# EAGLE design Rocket-Control4 (EAGLE 7.6.0)
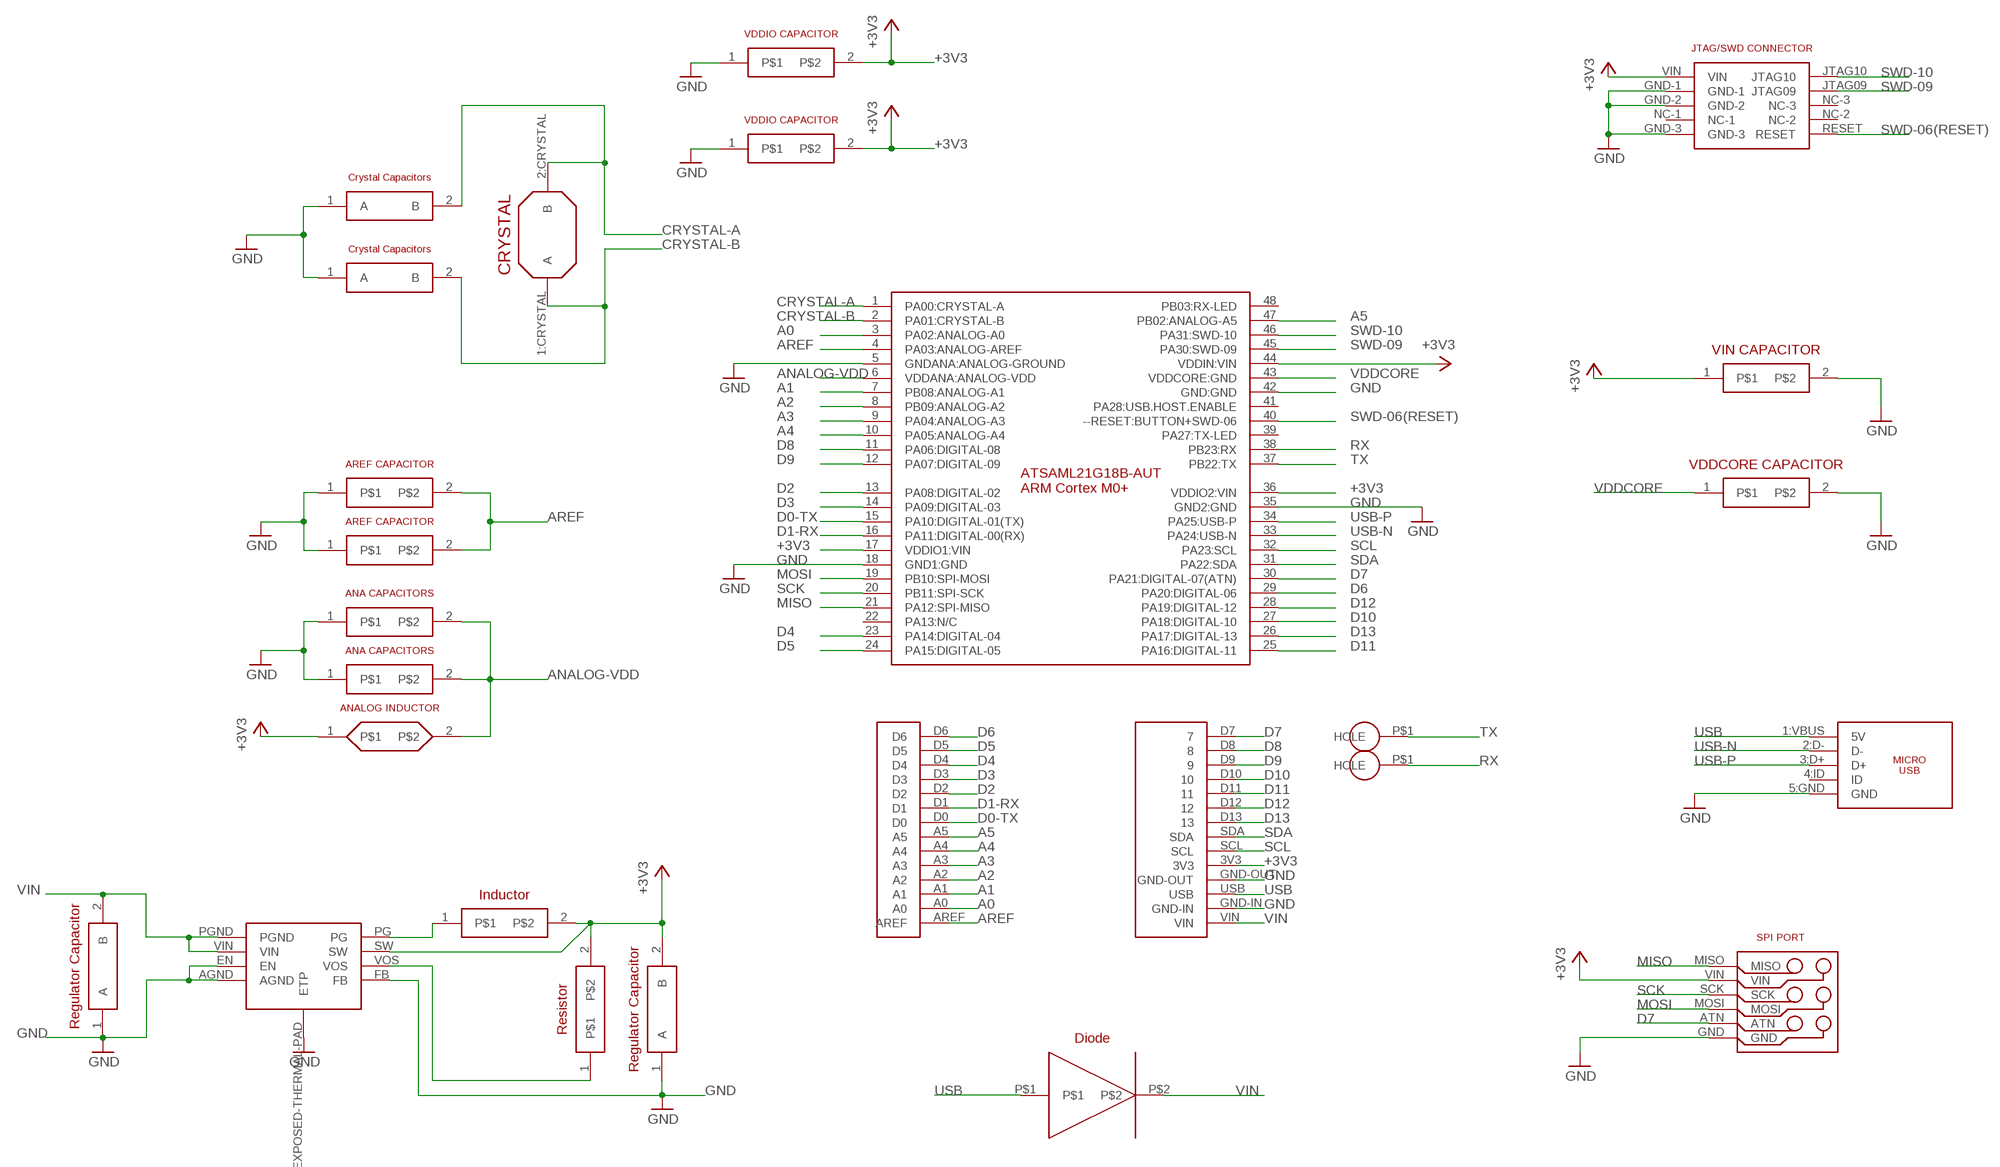
[diagram p0: schematic, sheet 1]

## Parts
U$1  ATSAML21G18B-AUT  [TQFP48]
U$2  CRYSTAL-CAPACITORS  [C0603]
U$3  CRYSTAL-CAPACITORS  [C0603]
U$4  CRYSTAL  [4-SOJ:CRYSTAL]
U$5  REGULATOR  [8-WFDFN-EXPOSED-PAD]
U$6  AREF-CAPACITORS  [C0402]
U$7  AREF-CAPACITORS  [C0402]
U$8  ANALOG-CAPACITORS  [C0402]
U$9  ANALOG-CAPACITORS  [C0402]
U$10  ANALOG-INDUCTOR  [C0603]
U$11  REGULATOR-CAPACITORS  [C0402]
U$12  REGULATOR-CAPACITORS  [C0402]
U$13  REGULATOR-INDUCTOR  [C0603]
U$14  REGULATOR-RESISTOR  [C0603]
U$15  REGULATION-DIODE  [SOD-882]
U$16  HEADER-HOLE  [HEADER-HOLE]
U$17  HEADER-HOLE  [HEADER-HOLE]
U$21  HEADER-SIDE-A  [HEADER-SIDE-A]
U$22  HEADER-SIDE-B  [HEADER-SIDE-B]
U$26  VDDIO-CAPACITOR  [C0402]
U$35  VDDIO-CAPACITOR  [C0402]
U$38  10118194-0001LF:MICRO-USB  [10118194-0001LF:MICRO-USB-B]
U$41  SPI-PORT  [SPI-PORT]
U$56  VDDCORE-CAPACITOR  [C0402]
U$57  VIN-CAPACITOR  [C0402]
U$61  JTAG-MINI  [JTAG-MINI]

## Nets
+3V3: U$1.17(VDDIO1:VIN) U$1.36(VDDIO2:VIN) U$1.44(VDDIN:VIN) U$5.SW U$10.1 U$12.2(B) U$13.2 U$14.2 U$22.3V3 U$26.2 U$35.2 U$41.VIN U$57.1 U$61.VIN
A0: U$1.3(PA02:ANALOG-A0) U$21.A0
A1: U$1.7(PB08:ANALOG-A1) U$21.A1
A2: U$1.8(PB09:ANALOG-A2) U$21.A2
A3: U$1.9(PA04:ANALOG-A3) U$21.A3
A4: U$1.10(PA05:ANALOG-A4) U$21.A4
A5: U$1.47(PB02:ANALOG-A5) U$21.A5
ANALOG-VDD: U$1.6(VDDANA:ANALOG-VDD) U$8.2 U$9.2 U$10.2
AREF: U$1.4(PA03:ANALOG-AREF) U$6.2 U$7.2 U$21.AREF
CRYSTAL-A: U$1.1(PA00:CRYSTAL-A) U$2.2(B) U$4.2:CRYSTAL(B)
CRYSTAL-B: U$1.2(PA01:CRYSTAL-B) U$3.2(B) U$4.1:CRYSTAL(A)
D0-TX: U$1.15(PA10:DIGITAL-01(TX)) U$21.D0
D1-RX: U$1.16(PA11:DIGITAL-00(RX)) U$21.D1
D2: U$1.13(PA08:DIGITAL-02) U$21.D2
D3: U$1.14(PA09:DIGITAL-03) U$21.D3
D4: U$1.23(PA14:DIGITAL-04) U$21.D4
D5: U$1.24(PA15:DIGITAL-05) U$21.D5
D6: U$1.29(PA20:DIGITAL-06) U$21.D6
D7: U$1.30(PA21:DIGITAL-07(ATN)) U$22.D7 U$41.ATN
D8: U$1.11(PA06:DIGITAL-08) U$22.D8
D9: U$1.12(PA07:DIGITAL-09) U$22.D9
D10: U$1.27(PA18:DIGITAL-10) U$22.D10
D11: U$1.25(PA16:DIGITAL-11) U$22.D11
D12: U$1.28(PA19:DIGITAL-12) U$22.D12
D13: U$1.26(PA17:DIGITAL-13) U$22.D13
GND: U$1.5(GNDANA:ANALOG-GROUND) U$1.18(GND1:GND) U$1.35(GND2:GND) U$1.42(GND:GND) U$2.1(A) U$3.1(A) U$5.AGND U$5.EN U$5.EXPOSED-THERMAL-PAD(ETP) U$5.FB U$6.1 U$7.1 U$8.1 U$9.1 U$11.1(A) U$12.1(A) U$22.GND-IN U$22.GND-OUT U$26.1 U$35.1 U$38.5:GND(GND) U$41.GND U$56.2 U$57.2 U$61.GND-1 U$61.GND-2 U$61.GND-3
MISO: U$1.21(PA12:SPI-MISO) U$41.MISO
MOSI: U$1.19(PB10:SPI-MOSI) U$41.MOSI
N$1: U$5.PG U$13.1
N$3: U$5.VOS U$14.1
RX: U$1.38(PB23:RX) U$17.P$1(HOLE)
SCK: U$1.20(PB11:SPI-SCK) U$41.SCK
SCL: U$1.32(PA23:SCL) U$22.SCL
SDA: U$1.31(PA22:SDA) U$22.SDA
SWD-06(RESET): U$1.40(--RESET:BUTTON+SWD-06) U$61.RESET
SWD-09: U$1.45(PA30:SWD-09) U$61.JTAG09
SWD-10: U$1.46(PA31:SWD-10) U$61.JTAG10
TX: U$1.37(PB22:TX) U$16.P$1(HOLE)
USB: U$15.P$1 U$22.USB U$38.1:VBUS(5V)
USB-N: U$1.33(PA24:USB-N) U$38.2:D-(D-)
USB-P: U$1.34(PA25:USB-P) U$38.3:D+(D+)
VDDCORE: U$1.43(VDDCORE:GND) U$56.1
VIN: U$5.PGND U$5.VIN U$11.2(B) U$15.P$2 U$22.VIN
Unconnected: U$1.22(PA13:N/C) U$1.39(PA27:TX-LED) U$1.41(PA28:USB.HOST.ENABLE) U$1.48(PB03:RX-LED) U$38.4:ID(ID) U$61.NC-1 U$61.NC-2 U$61.NC-3

## Library data of the parts
U$1 = RocketControlBoard:ATSAML21G18B-AUT
U$2 U$3 = RocketControlBoard:CRYSTAL-CAPACITORS
U$4 = RocketControlBoard:CRYSTAL
U$5 = RocketControlBoard:REGULATOR
U$6 U$7 = RocketControlBoard:AREF-CAPACITORS
U$8 U$9 = RocketControlBoard:ANALOG-CAPACITORS
U$10 = RocketControlBoard:ANALOG-INDUCTOR
U$11 U$12 = RocketControlBoard:REGULATOR-CAPACITORS
U$13 = RocketControlBoard:REGULATOR-INDUCTOR
U$14 = RocketControlBoard:REGULATOR-RESISTOR
U$15 = RocketControlBoard:REGULATION-DIODE
U$16 U$17 = RocketControlBoard:HEADER-HOLE
U$21 = RocketControlBoard:HEADER-SIDE-A
U$22 = RocketControlBoard:HEADER-SIDE-B
U$26 U$35 = RocketControlBoard:VDDIO-CAPACITOR
U$38 = RocketControlBoard:10118194-0001LF:MICRO-USB
U$41 = RocketControlBoard:SPI-PORT
U$56 = RocketControlBoard:VDDCORE-CAPACITOR
U$57 = RocketControlBoard:VIN-CAPACITOR
U$61 = RocketControlBoard:JTAG-MINI

## Board
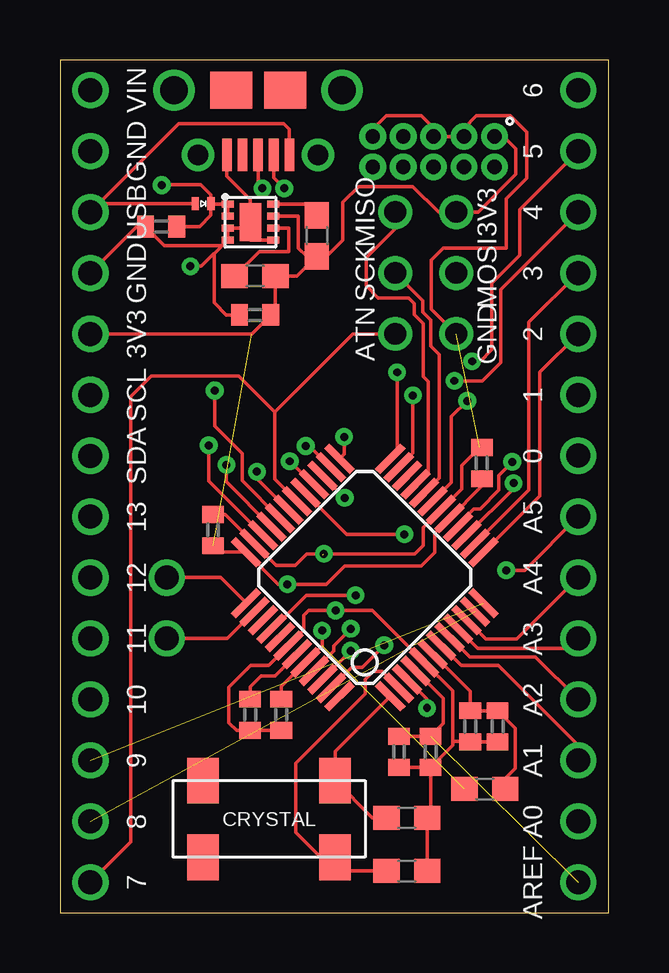
[diagram p1: board, top side]
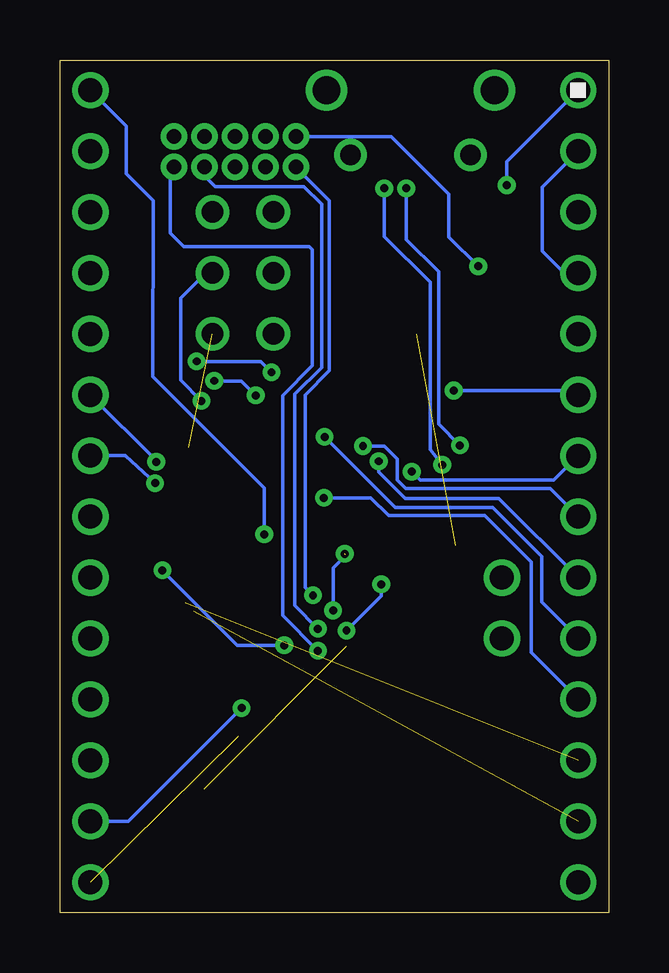
[diagram p2: board, bottom side, seen from below]

Size 22.86 x 35.55 mm. Coordinates in mm from the lower left corner, seen from the top.
Outline: 0,0 22.86,0 22.86,35.55 0,35.55 0,0
Copper layers (1*16): Top 0.035mm / dielectric 1.5mm / Bottom 0.035mm
Design rules "pcbway": minimum track width 6mil, minimum drill 12mil, track to track 6mil, track to pad 6mil, pad to pad 6mil, via to via 6mil, smd to smd 6mil, copper to edge 6mil, drill to drill 6mil, minimum pad ring 10mil, minimum via ring 8mil, stop-mask expansion 4mil, vias tented up to drill 0mil, thermal gap 10mil

### Footprints (pad centres in the part's own frame; a part is rotated, then mirrored left to right if it is on the bottom)
TQFP48 = smd 0.3 x 1.5: 1 -2.75,-4.25; 2 -2.25,-4.25; 3 -1.75,-4.25; 4 -1.25,-4.25; 5 -0.75,-4.25; 6 -0.25,-4.25; 7 0.25,-4.25; 8 0.75,-4.25; 9 1.25,-4.25; 10 1.75,-4.25; 11 2.25,-4.25; 12 2.75,-4.25; 25 2.75,4.25; 26 2.25,4.25; 27 1.75,4.25; 28 1.25,4.25; 29 0.75,4.25; 30 0.25,4.25; 31 -0.25,4.25; 32 -0.75,4.25; 33 -1.25,4.25; 34 -1.75,4.25; 35 -2.25,4.25; 36 -2.75,4.25 | smd 1.5 x 0.3: 13 4.25,-2.75; 14 4.25,-2.25; 15 4.25,-1.75; 16 4.25,-1.25; 17 4.25,-0.75; 18 4.25,-0.25; 19 4.25,0.25; 20 4.25,0.75; 21 4.25,1.25; 22 4.25,1.75; 23 4.25,2.25; 24 4.25,2.75; 37 -4.25,2.75; 38 -4.25,2.25; 39 -4.25,1.75; 40 -4.25,1.25; 41 -4.25,0.75; 42 -4.25,0.25; 43 -4.25,-0.25; 44 -4.25,-0.75; 45 -4.25,-1.25; 46 -4.25,-1.75; 47 -4.25,-2.25; 48 -4.25,-2.75
C0603 = smd 1.1 x 1: 1 -0.85,0; 2 0.85,0
4-SOJ:CRYSTAL = smd 1.3 x 1.9: 1:CRYSTAL -2.75,1.6; 2:CRYSTAL -2.75,-1.6; 3:N/C 2.75,1.6; 4:N/C 2.75,-1.6
8-WFDFN-EXPOSED-PAD = smd 0.28 x 0.5: AGND 1.5,0; EN 1,0; FB 1.5,1.9; PG 0,1.9; PGND 0,0; SW 0.5,1.9; VIN 0.5,0; VOS 1,1.9 | smd 1.6 x 0.9: EXPOSED-THERMAL-PAD 0.75,0.95
C0402 = smd 0.7 x 0.9: 1 -0.65,0; 2 0.65,0
SOD-882 = smd 0.3 x 0.55: P$1 0,0; P$2 0.65,0
HEADER-HOLE = drill 1: P$1 0,0
HEADER-SIDE-A = drill 1: A0 0,-12.7; A1 0,-10.16; A2 0,-7.62; A3 0,-5.08; A4 0,-2.54; A5 0,0; AREF 0,-15.24; D0 0,2.54; D1 0,5.08; D2 0,7.62; D3 0,10.16; D4 0,12.7; D5 0,15.24; D6 0,17.78
HEADER-SIDE-B = drill 1: 3V3 -12.7,0; D7 -35.56,0; D8 -33.02,0; D9 -30.48,0; D10 -27.94,0; D11 -25.4,0; D12 -22.86,0; D13 -20.32,0; GND-IN -5.08,0; GND-OUT -10.16,0; SCL -15.24,0; SDA -17.78,0; USB -7.62,0; VIN -2.54,0
10118194-0001LF:MICRO-USB-B = smd 1.35 x 0.4: 1:VBUS 2.7,1.3; 2:D- 2.7,0.65; 3:D+ 2.7,0; 4:ID 2.7,-0.65; 5:GND 2.7,-1.3 | drill 0.85: NC1 2.7,2.5; NC6 2.7,-2.5 | drill 1.15: NC2 0,3.5; NC5 0,-3.5 | smd 1.55 x 1.75: NC3 0,1.125; NC4 0,-1.125
SPI-PORT = drill 0.9: ATN 0,0; GND 2.54,0; MISO 0,5.08; MOSI 2.54,2.54; SCK 0,2.54; VIN 2.54,5.08
JTAG-MINI = drill 0.6: GND-1 0.635,4.445; GND-2 0.635,3.175; GND-3 0.635,0.635; JTAG09 1.905,4.445; JTAG10 1.905,5.715; NC-1 0.635,1.905; NC-2 1.905,1.905; NC-3 1.905,3.175; RESET 1.905,0.635; VIN 0.635,5.715

### Placement (x,y rotation side)
U$1  12.7,13.97 45 top
U$2  14.45,3.96 180 top
U$3  14.45,1.75 180 top
U$4  8.71,3.91 180 top
U$5  6.99,29.54 270 top
U$6  15.44,6.71 90 top
U$7  14.12,6.71 90 top
U$8  18.24,7.77 90 top
U$9  17.09,7.77 90 top
U$10  17.7,5.16 0 top
U$11  4.22,28.6 0 top
U$12  8.13,24.92 0 top
U$13  10.69,28.22 270 top
U$14  8.13,26.54 0 top
U$15  5.64,29.57 0 top
U$16  4.45,13.97 0 top
U$17  4.45,11.43 0 top
U$21  21.59,16.51 0 top
U$22  1.27,36.83 90 top
U$26  17.58,18.75 270 top
U$35  6.38,15.95 270 top
U$38  8.26,34.29 270 top
U$41  13.97,24.13 0 top
U$56  7.92,8.26 270 top
U$57  9.22,8.26 270 top
U$61  12.4,32.99 270 top

### Tracks (layer width: path | path; a pad name or v marks a point on that pad's centre or on a via)
+3V3  (via drill 0.33)  (2 unrouted)
  Top 0.152: U$1.44 9.77,9.98 | U$61.VIN 18.49,32.36 19,31.85 19,30.79 17.42,29.21 U$41.VIN 15.77,29.21 14.71,30.28 12.45,30.28 11.79,29.62 11.79,28.04 11.11,27.37 U$13.2 | U$26.2 17.58,17.79 U$1.17 15.62,15.83 15.62,15.01 15.06,14.45 11.86,14.45 11.1,13.69 v9.47,13.69 9.09,13.69 U$1.36 6.65,15.03 U$35.2 | U$1.44 9.22,9.43 U$57.1 | U$5.SW 9.93,29.04 9.93,27.71 10.27,27.37 U$13.2 | U$13.2 9.87,26.54 U$14.2 8.98,25.12 U$12.2 7.99,24.13 U$22.3V3 | U$1.44 10.92,11.13 v10.92,11.76
  Bottom 0.152: v10.92,11.76 9.47,13.21 v9.47,13.69
A0  (via drill 0.33)
  Top 0.152: U$1.3 15.29,8.9 v15.29,8.53
  Bottom 0.152: U$21.A0 20.02,3.81 v15.29,8.53
A1
  Top 0.152: U$1.7 16.71,10.31 18.26,10.31 21.59,6.99 U$21.A1
A2
  Top 0.152: U$1.8 17.06,10.67 19.81,10.67 U$21.A2
A3
  Top 0.152: U$1.9 17.41,11.02 21.18,11.02 U$21.A3
A4
  Top 0.152: U$1.10 17.74,11.4 19.02,11.4 U$21.A4
A5  (via drill 0.33)
  Top 0.152: U$21.A5 19.36,14.28 v18.59,14.28 | U$1.47 12.15,10.24 12.6,10.24 v13.51,11.15
  Bottom 0.152: v18.59,14.28 15.47,11.15 v13.51,11.15
ANALOG-VDD
  Top 0.152: U$1.6 17.09,9.22 U$9.2 U$8.2 18.97,7.69 18.97,6.02 18.55,5.6 U$10.2
AREF  (1 unrouted)
  Top 0.152: U$7.2 U$6.2 15.98,7.89 15.98,8.93 U$1.4
CRYSTAL-A
  Top 0.152: U$1.1 11.46,6.72 U$4.2:CRYSTAL 13.01,3.96 U$2.2
CRYSTAL-B
  Top 0.152: U$1.2 13.43,10.06 13.06,10.06 12.72,9.73 12.72,9.12 9.83,6.22 9.83,3.35 10.87,2.31 U$4.1:CRYSTAL 12.02,1.75 U$3.2
D0-TX  (via drill 0.33)
  Top 0.152: U$1.15 18.9,17.69 v18.9,17.91
  Bottom 0.152: U$21.D0 20.14,19.05 v18.9,17.91
D1-RX  (via drill 0.33)
  Top 0.152: v18.85,18.8 18.29,18.24 18.29,17.63 17.5,16.84 17.25,16.84 16.76,16.36 16.76,16.27 U$1.16
  Bottom 0.152: U$21.D1 18.85,18.85 v18.85,18.8
D2
  Top 0.152: U$1.13 19.99,17.37 19.99,22.53 U$21.D2
D3
  Top 0.152: U$1.14 19.53,17.62 19.53,24.61 U$21.D3
D4  (via drill 0.33)
  Top 0.152: U$21.D4 18.36,25.98 18.36,22.94 17.6,22.17 v16.43,22.17 | v14.71,21.57 14.71,19.16 U$1.23
  Bottom 0.152: v16.43,22.17 15.32,22.17 v14.71,21.57
D5  (via drill 0.33)
  Top 0.152: U$21.D5 19.15,29.31 19.15,27.41 17.98,26.24 17.98,23.47 17.5,22.99 v17.17,22.99 | v14.05,22.53 14.05,19.2 U$1.24
  Bottom 0.152: v17.17,22.99 14.5,22.99 v14.05,22.53
D6  (via drill 0.33)
  Top 0.152: U$1.29 11.96,15.77 v14.35,15.77
  Bottom 0.152: U$21.D6 20.09,32.79 20.09,30.81 18.97,29.69 19,22.35 14.35,17.7 v14.35,15.77
D7
  Top 0.152: U$22.D7 2.95,2.95 2.95,21.51 3.81,22.38 7.44,22.38 8.94,20.88 | 8.94,20.88 8.94,18.08 U$1.30 | 8.94,20.88 12.19,24.13 U$41.ATN
D8  (1 unrouted)
D9  (1 unrouted)
D10  (via drill 0.33)
  Top 0.152: v11.86,17.3 U$1.27
  Bottom 0.152: U$22.D10 3.23,10.85 3.23,14.63 5.16,16.56 9.17,16.56 9.91,17.3 v11.86,17.3
D11  (via drill 0.33)
  Top 0.152: U$1.25 11.84,19.12 v11.84,19.84
  Bottom 0.152: U$22.D11 2.79,12.95 2.79,14.86 4.83,16.89 8.89,16.89 v11.84,19.84
D12  (via drill 0.33)
  Top 0.152: U$1.28 10.54,17.86 v9.58,18.82
  Bottom 0.152: v9.58,18.82 9.58,18.36 8.48,17.27 4.57,17.27 U$22.D12
D13  (via drill 0.33)
  Top 0.152: v10.24,19.46 10.4,19.46 U$1.26
  Bottom 0.152: v10.24,19.46 9.35,19.46 8.81,18.92 8.81,18.03 8.46,17.68 2.44,17.68 U$22.D13
GND  (via drill 0.33)  (2 unrouted)
  Top 0.152: U$5.EXPOSED-THERMAL-PAD 7.68,28.54 U$5.EN U$5.AGND | U$5.FB 7.93,28.04 U$5.EXPOSED-THERMAL-PAD | U$38.5:GND 6.96,30.71 7.93,29.73 U$5.EXPOSED-THERMAL-PAD | U$61.GND-3 13.03,32.66 13.59,33.22 15.06,33.22 15.57,32.72 U$61.GND-2 U$61.GND-1 16.84,32.72 17.35,33.22 18.77,33.22 19.46,32.54 19.46,30.63 18.59,29.77 18.59,27.71 15.98,27.71 15.47,27.2 15.47,25.17 U$41.GND | U$26.1 17.49,19.39 16.74,18.64 16.74,17.66 U$1.18 15.14,16.05 15.14,15.32 14.78,14.96 v11,14.96 10.29,14.96 9.8,14.48 9.01,14.48 U$1.35 6.89,16.6 U$35.1 | U$57.2 U$56.2 7.36,7.61 7.04,7.92 7.04,9.4 7.95,10.31 8.69,10.31 U$1.42 10.16,11.78 10.16,12.39 10.36,12.6 v11.48,12.6 13.01,12.6 U$1.5 16.36,9.25 16.36,7.14 | U$8.1 U$9.1 17.08,7.14 16.36,7.14 | 16.36,7.14 16.37,7.12 | U$7.1 U$6.1 | U$6.1 16.36,6.97 16.36,7.14 | U$3.1 U$2.1 15.44,4.1 U$6.1 | U$5.AGND 6.76,27.81 4.35,27.81 U$11.1 3.2,28.6 U$22.GND-OUT | U$12.1 6.93,24.92 6.43,25.43 6.43,27.48 U$5.AGND | v5.44,26.95 5.89,26.95 U$5.AGND
  Bottom 0.152: U$22.GND-IN 2.77,30.25 2.77,27.58 1.85,26.67 U$22.GND-OUT | U$61.GND-3 9.07,32.36 6.66,29.95 6.66,28.17 v5.44,26.95 | 10.95,14.91 11.48,14.38 v11.48,12.6
MISO
  Top 0.152: U$1.21 15.34,18.38 15.34,22.15 15.14,22.35 15.14,24.56 14.76,24.94 14.76,25.4 14.53,25.63 13.26,25.63 12.75,26.14 12.75,27.3 13.97,28.52 U$41.MISO
MOSI  (via drill 0.33)
  Top 0.152: U$1.19 16.31,17.93 16.31,20.68 v16.97,21.34
  Bottom 0.152: v16.97,21.34 17.83,22.2 17.83,25.63 16.79,26.67 U$41.MOSI
N$1
  Top 0.152: U$5.PG 10.22,29.54 U$13.1
N$3
  Top 0.152: U$5.VOS 9.53,28.54 9.53,27.56 8.29,27.56 U$14.1
RX
  Top 0.152: U$1.38 6.98,11.43 U$17.P$1
SCK
  Top 0.152: U$1.20 15.8,18.13 15.8,23.27 15.44,23.62 15.44,24.71 15.11,25.04 15.11,25.53 U$41.SCK
SCL  (via drill 0.33)
  Top 0.152: U$1.32 7.59,18.02 7.59,19.15 6.45,20.3 v6.45,21.77
  Bottom 0.152: v6.45,21.77 1.45,21.77 U$22.SCL
SDA  (via drill 0.33)
  Top 0.152: U$1.31 8.2,18.11 v8.2,18.39
  Bottom 0.152: v8.2,18.39 7.85,18.03 2.29,18.03 U$22.SDA
SWD-06(RESET)  (via drill 0.33)
  Top 0.152: U$1.40 8.88,11.85 10.26,13.23 v12.32,13.23
  Bottom 0.152: U$61.RESET 11.63,29.69 11.63,22.61 12.65,21.59 12.65,13.56 v12.32,13.23
SWD-09  (via drill 0.33)
  Top 0.152: 10.62,10.24 10.62,10.12 U$1.45 10.58,10.1 11.4,10.92 11.4,11.12 v12.12,11.84
  Bottom 0.152: 12.42,11.84 v12.12,11.84 13.08,12.8 13.08,21.61 11.96,22.73 11.96,29.54 12.7,30.28 16.38,30.28 16.84,30.73 U$61.JTAG09
SWD-10  (via drill 0.33)
  Top 0.152: v12.12,10.92 v12.12,10.91 U$1.46
  Bottom 0.152: U$61.JTAG10 18.26,30.94 18.26,28.32 17.7,27.76 12.47,27.76 12.34,27.64 12.34,22.81 13.59,21.57 13.59,12.39 v12.12,10.92
TX
  Top 0.152: U$16.P$1 6.69,13.97 U$1.37
USB
  Top 0.152: U$15.P$1 1.63,29.57 U$22.USB 4.95,32.89 9.32,32.89 9.55,32.66 U$38.1:VBUS
USB-N  (via drill 0.33)
  Top 0.152: v6.93,18.67 6.93,17.97 U$1.33 | U$38.2:D- 8.9,30.64 v9.35,30.2
  Bottom 0.152: v6.93,18.67 7.44,19.3 7.44,26.29 9.35,28.19 v9.35,30.2
USB-P  (via drill 0.33)
  Top 0.152: v6.2,19.48 6.2,18 U$1.34 | v8.43,30.2 8.26,30.38 U$38.3:D+
  Bottom 0.152: v8.43,30.2 8.43,28.07 7.09,26.72 7.09,20.37 v6.2,19.48
VDDCORE
  Top 0.152: 9.77,10.79 U$1.43 8.96,9.88 8.38,9.88 7.92,9.42 U$56.1
VIN  (via drill 0.33)
  Top 0.152: U$15.P$2 6.29,29.93 5.87,30.35 4.27,30.35 v4.24,30.33 | U$15.P$2 6.31,29.54 U$5.PGND U$5.VIN | U$11.2 5.82,28.6 6.29,29.07 U$15.P$2
  Bottom 0.152: U$22.VIN 4.24,31.32 v4.24,30.33